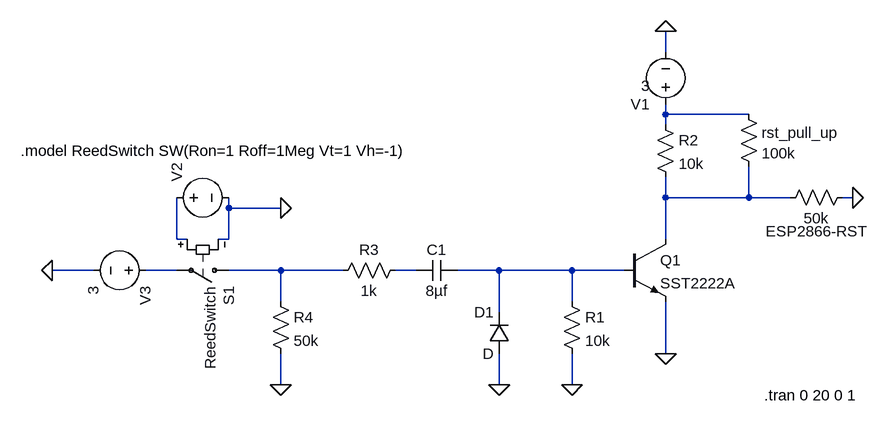
[diagram p0: schematic pulsegen_high.asc]
pulsegen_high.asc, the LTspice schematic file:
Version 4
SHEET 1 2516 1092
WIRE 1536 -16 1536 -48
WIRE 1536 80 1536 64
WIRE 1664 80 1536 80
WIRE 1536 96 1536 80
WIRE 1536 208 1536 176
WIRE 1664 208 1664 160
WIRE 1664 208 1536 208
WIRE 1728 208 1664 208
WIRE 1824 208 1808 208
WIRE 864 224 864 208
WIRE 944 224 864 224
WIRE 784 272 784 208
WIRE 800 272 784 272
WIRE 864 272 864 224
WIRE 864 272 848 272
WIRE 1536 272 1536 208
WIRE 656 320 592 320
WIRE 784 320 736 320
WIRE 944 320 864 320
WIRE 1040 320 944 320
WIRE 1152 320 1120 320
WIRE 1280 320 1216 320
WIRE 1392 320 1280 320
WIRE 1472 320 1392 320
WIRE 944 368 944 320
WIRE 1392 368 1392 320
WIRE 1280 384 1280 320
WIRE 1536 448 1536 368
WIRE 944 496 944 448
WIRE 1280 496 1280 448
WIRE 1392 496 1392 448
FLAG 1536 -48 0
FLAG 1280 496 0
FLAG 1392 496 0
FLAG 1536 448 0
FLAG 944 224 0
FLAG 1824 208 0
FLAG 592 320 0
FLAG 944 496 0
SYMBOL voltage 1536 80 R180
WINDOW 3 24 44 Left 2
WINDOW 123 0 0 Left 0
WINDOW 39 0 0 Left 0
SYMATTR Value 3
SYMATTR InstName V1
SYMBOL voltage 768 208 R270
WINDOW 3 24 96 Invisible 2
WINDOW 123 0 0 Left 0
WINDOW 39 0 0 Left 0
SYMATTR Value PULSE(0 3 2 0 0 4 10 2)
SYMATTR InstName V2
SYMBOL sw 880 320 R90
WINDOW 3 24 44 Left 2
SYMATTR Value ReedSwitch
SYMATTR InstName S1
SYMBOL res 1824 192 R90
WINDOW 0 83 55 VBottom 2
WINDOW 3 32 56 VTop 2
SYMATTR InstName ESP2866-RST
SYMATTR Value 50k
SYMBOL cap 1216 304 R90
WINDOW 0 0 32 VBottom 2
WINDOW 3 32 32 VTop 2
SYMATTR InstName C1
SYMATTR Value 8µf
SYMATTR SpiceLine V=4
SYMBOL diode 1296 448 R180
WINDOW 0 24 64 Left 2
WINDOW 3 24 0 Left 2
SYMATTR InstName D1
SYMBOL res 1376 352 R0
SYMATTR InstName R1
SYMATTR Value 10k
SYMBOL npn 1472 272 R0
SYMATTR InstName Q1
SYMATTR Value SST2222A
SYMBOL res 1520 80 R0
SYMATTR InstName R2
SYMATTR Value 10k
SYMBOL voltage 752 320 R90
WINDOW 123 0 0 Left 0
WINDOW 39 0 0 Left 0
SYMATTR InstName V3
SYMATTR Value 3
SYMBOL res 1136 304 R90
WINDOW 0 0 56 VBottom 2
WINDOW 3 32 56 VTop 2
SYMATTR InstName R3
SYMATTR Value 1k
SYMBOL res 928 352 R0
SYMATTR InstName R4
SYMATTR Value 50k
SYMBOL res 1648 64 R0
WINDOW 0 36 44 Left 2
SYMATTR InstName rst_pull_up
SYMATTR Value 100k
TEXT 1688 512 Left 2 !.tran 0 20 0 1
TEXT 544 136 Left 2 !.model ReedSwitch SW(Ron=1 Roff=1Meg Vt=1 Vh=-1)

The netlist it stands for:
* pulsegen_high.asc
V1 N001 0 3
V2 N003 0 PULSE(0 3 2 0 0 4 10 2)
S1 N005 N004 N003 0 ReedSwitch
R§ESP2866-RST 0 N002 50k
C1 N007 N006 8µf V=4
D1 0 N007 D
R1 N007 0 10k
Q1 N002 N007 0 0 SST2222A
R2 N001 N002 10k
V3 N004 0 3
R3 N006 N005 1k
R4 N005 0 50k
rst_pull_up N001 N002 100k
.model D D
.lib standard.dio
.model NPN NPN
.model PNP PNP
.lib standard.bjt
.tran 0 20 0 1
.model ReedSwitch SW(Ron=1 Roff=1Meg Vt=1 Vh=-1)
.backanno
.end